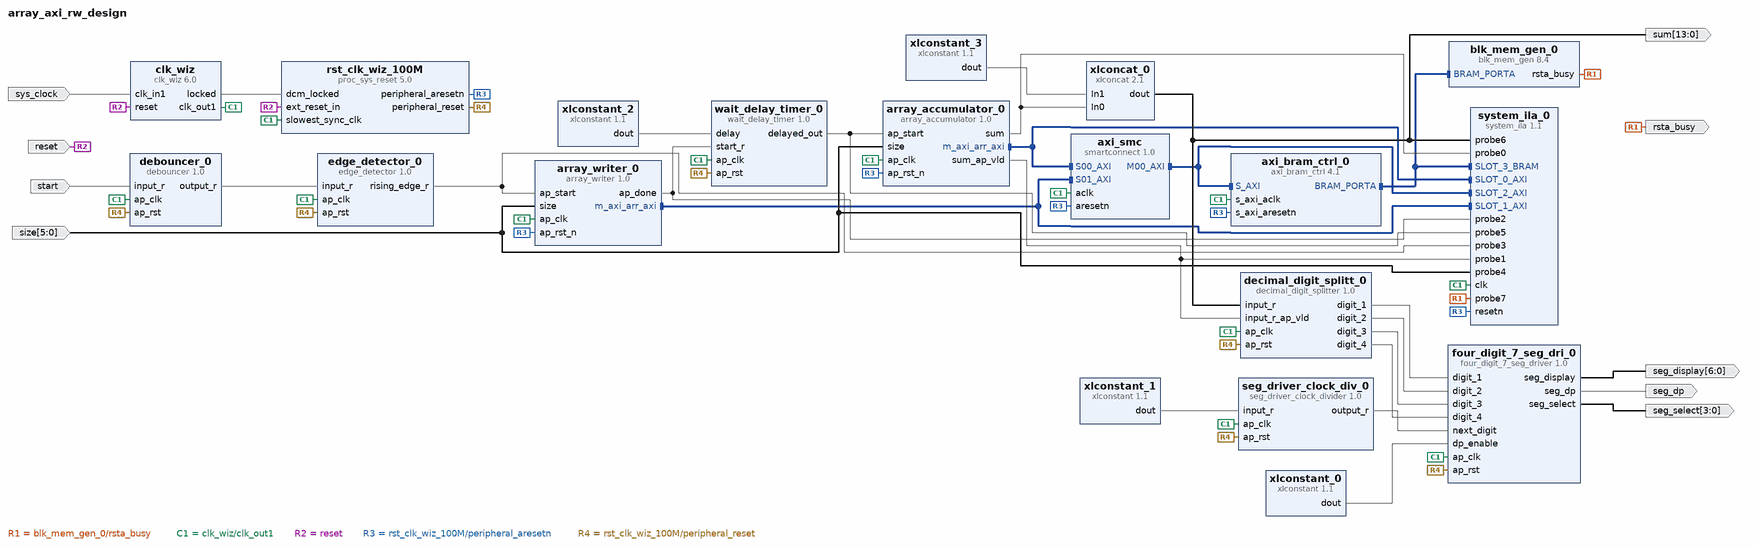
[diagram p0: block diagram of the top level]
# Vivado block design array_axi_rw_design, xc7a35tcpg236-1, Vivado 2023.2
create_bd_design array_axi_rw_design

create_bd_port -dir I -from 5 -to 0 -type data size
create_bd_port -dir O -from 6 -to 0 -type data seg_display
create_bd_port -dir O -from 3 -to 0 -type data seg_select
create_bd_port -dir O -type data seg_dp
create_bd_port -dir I -type data start
create_bd_port -dir I -type clk sys_clock
set_property -dict {CONFIG.FREQ_HZ 100000000 CONFIG.PHASE 0.0} [get_bd_ports sys_clock]
create_bd_port -dir I -type rst reset
set_property -dict {CONFIG.POLARITY ACTIVE_HIGH} [get_bd_ports reset]
create_bd_port -dir O -from 13 -to 0 sum
create_bd_port -dir O rsta_busy

create_bd_cell -type ip -vlnv xilinx.com:hls:array_accumulator:1.0 array_accumulator_0
create_bd_cell -type ip -vlnv xilinx.com:ip:xlconcat:2.1 xlconcat_0
set_property -dict {CONFIG.IN0_WIDTH 13 CONFIG.IN1_WIDTH 1} [get_bd_cells xlconcat_0]
create_bd_cell -type ip -vlnv xilinx.com:hls:decimal_digit_splitter:1.0 decimal_digit_splitt_0
create_bd_cell -type ip -vlnv xilinx.com:hls:four_digit_7_seg_driver:1.0 four_digit_7_seg_dri_0
create_bd_cell -type ip -vlnv xilinx.com:ip:xlconstant:1.1 xlconstant_0
set_property -dict {CONFIG.CONST_VAL 0 CONFIG.CONST_WIDTH 4} [get_bd_cells xlconstant_0]
create_bd_cell -type ip -vlnv xilinx.com:hls:seg_driver_clock_divider:1.0 seg_driver_clock_div_0
create_bd_cell -type ip -vlnv xilinx.com:ip:xlconstant:1.1 xlconstant_1
create_bd_cell -type ip -vlnv xilinx.com:hls:array_writer:1.0 array_writer_0
create_bd_cell -type ip -vlnv xilinx.com:hls:wait_delay_timer:1.0 wait_delay_timer_0
create_bd_cell -type ip -vlnv xilinx.com:ip:xlconstant:1.1 xlconstant_2
set_property -dict {CONFIG.CONST_VAL 3 CONFIG.CONST_WIDTH 8} [get_bd_cells xlconstant_2]
create_bd_cell -type ip -vlnv xilinx.com:ip:axi_bram_ctrl:4.1 axi_bram_ctrl_0
set_property -dict {CONFIG.SINGLE_PORT_BRAM 1} [get_bd_cells axi_bram_ctrl_0]
create_bd_cell -type ip -vlnv xilinx.com:ip:blk_mem_gen:8.4 blk_mem_gen_0
create_bd_cell -type ip -vlnv xilinx.com:ip:clk_wiz:6.0 clk_wiz
set_property -dict [list \
  CONFIG.CLK_IN1_BOARD_INTERFACE sys_clock \
  CONFIG.RESET_BOARD_INTERFACE reset \
  CONFIG.USE_BOARD_FLOW true \
] [get_bd_cells clk_wiz]
create_bd_cell -type ip -vlnv xilinx.com:ip:proc_sys_reset:5.0 rst_clk_wiz_100M
set_property -dict {CONFIG.RESET_BOARD_INTERFACE reset CONFIG.USE_BOARD_FLOW true} [get_bd_cells rst_clk_wiz_100M]
create_bd_cell -type ip -vlnv xilinx.com:ip:smartconnect:1.0 axi_smc
set_property -dict {CONFIG.NUM_SI 2} [get_bd_cells axi_smc]
create_bd_cell -type ip -vlnv xilinx.com:ip:xlconstant:1.1 xlconstant_3
set_property -dict {CONFIG.CONST_VAL 0} [get_bd_cells xlconstant_3]
create_bd_cell -type ip -vlnv xilinx.com:hls:debouncer:1.0 debouncer_0
create_bd_cell -type ip -vlnv xilinx.com:hls:edge_detector:1.0 edge_detector_0
create_bd_cell -type ip -vlnv xilinx.com:ip:system_ila:1.1 system_ila_0
set_property -dict [list \
  CONFIG.C_ADV_TRIGGER true \
  CONFIG.C_EN_STRG_QUAL 1 \
  CONFIG.C_MON_TYPE MIX \
  CONFIG.C_NUM_MONITOR_SLOTS 4 \
  CONFIG.C_NUM_OF_PROBES 8 \
  CONFIG.C_PROBE0_TYPE 0 \
  CONFIG.C_PROBE1_TYPE 0 \
  CONFIG.C_PROBE2_TYPE 0 \
  CONFIG.C_PROBE3_TYPE 0 \
  CONFIG.C_PROBE4_TYPE 0 \
  CONFIG.C_PROBE5_TYPE 0 \
  CONFIG.C_PROBE_WIDTH_PROPAGATION AUTO \
  CONFIG.C_SLOT_0_APC_EN 0 \
  CONFIG.C_SLOT_0_AXI_AR_SEL_DATA 1 \
  CONFIG.C_SLOT_0_AXI_AR_SEL_TRIG 1 \
  CONFIG.C_SLOT_0_AXI_AW_SEL_DATA 0 \
  CONFIG.C_SLOT_0_AXI_AW_SEL_TRIG 0 \
  CONFIG.C_SLOT_0_AXI_B_SEL_DATA 0 \
  CONFIG.C_SLOT_0_AXI_B_SEL_TRIG 0 \
  CONFIG.C_SLOT_0_AXI_R_SEL_DATA 1 \
  CONFIG.C_SLOT_0_AXI_R_SEL_TRIG 1 \
  CONFIG.C_SLOT_0_AXI_W_SEL_DATA 0 \
  CONFIG.C_SLOT_0_AXI_W_SEL_TRIG 0 \
  CONFIG.C_SLOT_0_INTF_TYPE xilinx.com:interface:aximm_rtl:1.0 \
  CONFIG.C_SLOT_1_APC_EN 0 \
  CONFIG.C_SLOT_1_AXI_AR_SEL_DATA 0 \
  CONFIG.C_SLOT_1_AXI_AR_SEL_TRIG 0 \
  CONFIG.C_SLOT_1_AXI_AW_SEL_DATA 1 \
  CONFIG.C_SLOT_1_AXI_AW_SEL_TRIG 1 \
  CONFIG.C_SLOT_1_AXI_B_SEL_DATA 1 \
  CONFIG.C_SLOT_1_AXI_B_SEL_TRIG 1 \
  CONFIG.C_SLOT_1_AXI_R_SEL_DATA 0 \
  CONFIG.C_SLOT_1_AXI_R_SEL_TRIG 0 \
  CONFIG.C_SLOT_1_AXI_W_SEL_DATA 1 \
  CONFIG.C_SLOT_1_AXI_W_SEL_TRIG 1 \
  CONFIG.C_SLOT_1_INTF_TYPE xilinx.com:interface:aximm_rtl:1.0 \
  CONFIG.C_SLOT_2_APC_EN 0 \
  CONFIG.C_SLOT_2_AXI_AR_SEL_DATA 1 \
  CONFIG.C_SLOT_2_AXI_AR_SEL_TRIG 1 \
  CONFIG.C_SLOT_2_AXI_AW_SEL_DATA 1 \
  CONFIG.C_SLOT_2_AXI_AW_SEL_TRIG 1 \
  CONFIG.C_SLOT_2_AXI_B_SEL_DATA 1 \
  CONFIG.C_SLOT_2_AXI_B_SEL_TRIG 1 \
  CONFIG.C_SLOT_2_AXI_R_SEL_DATA 1 \
  CONFIG.C_SLOT_2_AXI_R_SEL_TRIG 1 \
  CONFIG.C_SLOT_2_AXI_W_SEL_DATA 1 \
  CONFIG.C_SLOT_2_AXI_W_SEL_TRIG 1 \
  CONFIG.C_SLOT_2_INTF_TYPE xilinx.com:interface:aximm_rtl:1.0 \
  CONFIG.C_SLOT_3_INTF_TYPE xilinx.com:interface:bram_rtl:1.0 \
  CONFIG.C_SLOT_3_TYPE 0 \
] [get_bd_cells system_ila_0]

# ---- connections ----

connect_bd_intf_net -intf_net array_accumulator_0_m_axi_arr_axi [get_bd_intf_pins array_accumulator_0/m_axi_arr_axi] [get_bd_intf_pins axi_smc/S00_AXI]
connect_bd_intf_net [get_bd_intf_pins array_accumulator_0/m_axi_arr_axi] [get_bd_intf_pins system_ila_0/SLOT_0_AXI]
connect_bd_intf_net -intf_net array_writer_0_m_axi_arr_axi [get_bd_intf_pins array_writer_0/m_axi_arr_axi] [get_bd_intf_pins axi_smc/S01_AXI]
connect_bd_intf_net [get_bd_intf_pins array_writer_0/m_axi_arr_axi] [get_bd_intf_pins system_ila_0/SLOT_1_AXI]
connect_bd_intf_net -intf_net axi_bram_ctrl_0_BRAM_PORTA [get_bd_intf_pins axi_bram_ctrl_0/BRAM_PORTA] [get_bd_intf_pins blk_mem_gen_0/BRAM_PORTA]
connect_bd_intf_net [get_bd_intf_pins axi_bram_ctrl_0/BRAM_PORTA] [get_bd_intf_pins system_ila_0/SLOT_3_BRAM]
connect_bd_intf_net -intf_net axi_smc_M00_AXI [get_bd_intf_pins axi_smc/M00_AXI] [get_bd_intf_pins axi_bram_ctrl_0/S_AXI]
connect_bd_intf_net [get_bd_intf_pins axi_smc/M00_AXI] [get_bd_intf_pins system_ila_0/SLOT_2_AXI]
connect_bd_net -net array_accumulator_0_sum [get_bd_pins array_accumulator_0/sum] [get_bd_pins xlconcat_0/In0] [get_bd_pins system_ila_0/probe0]
connect_bd_net -net array_accumulator_0_sum_ap_vld [get_bd_pins array_accumulator_0/sum_ap_vld] \
  [get_bd_pins decimal_digit_splitt_0/input_r_ap_vld] [get_bd_pins system_ila_0/probe1]
connect_bd_net -net array_writer_0_ap_done [get_bd_pins array_writer_0/ap_done] \
  [get_bd_pins wait_delay_timer_0/start_r] [get_bd_pins system_ila_0/probe2]
connect_bd_net [get_bd_pins blk_mem_gen_0/rsta_busy] [get_bd_ports rsta_busy] [get_bd_pins system_ila_0/probe7]
connect_bd_net [get_bd_pins clk_wiz/clk_out1] \
  [get_bd_pins rst_clk_wiz_100M/slowest_sync_clk] [get_bd_pins decimal_digit_splitt_0/ap_clk] \
  [get_bd_pins four_digit_7_seg_dri_0/ap_clk] [get_bd_pins seg_driver_clock_div_0/ap_clk] \
  [get_bd_pins array_accumulator_0/ap_clk] [get_bd_pins wait_delay_timer_0/ap_clk] [get_bd_pins axi_smc/aclk] \
  [get_bd_pins axi_bram_ctrl_0/s_axi_aclk] [get_bd_pins array_writer_0/ap_clk] [get_bd_pins debouncer_0/ap_clk] \
  [get_bd_pins edge_detector_0/ap_clk] [get_bd_pins system_ila_0/clk]
connect_bd_net [get_bd_pins clk_wiz/locked] [get_bd_pins rst_clk_wiz_100M/dcm_locked]
connect_bd_net [get_bd_pins debouncer_0/output_r] [get_bd_pins edge_detector_0/input_r]
connect_bd_net [get_bd_pins decimal_digit_splitt_0/digit_1] [get_bd_pins four_digit_7_seg_dri_0/digit_1]
connect_bd_net [get_bd_pins decimal_digit_splitt_0/digit_2] [get_bd_pins four_digit_7_seg_dri_0/digit_2]
connect_bd_net [get_bd_pins decimal_digit_splitt_0/digit_3] [get_bd_pins four_digit_7_seg_dri_0/digit_3]
connect_bd_net [get_bd_pins decimal_digit_splitt_0/digit_4] [get_bd_pins four_digit_7_seg_dri_0/digit_4]
connect_bd_net -net edge_detector_0_rising_edge_r [get_bd_pins edge_detector_0/rising_edge_r] \
  [get_bd_pins array_writer_0/ap_start] [get_bd_pins system_ila_0/probe3]
connect_bd_net [get_bd_pins four_digit_7_seg_dri_0/seg_display] [get_bd_ports seg_display]
connect_bd_net [get_bd_pins four_digit_7_seg_dri_0/seg_dp] [get_bd_ports seg_dp]
connect_bd_net [get_bd_pins four_digit_7_seg_dri_0/seg_select] [get_bd_ports seg_select]
connect_bd_net [get_bd_ports reset] [get_bd_pins clk_wiz/reset] [get_bd_pins rst_clk_wiz_100M/ext_reset_in]
connect_bd_net [get_bd_pins rst_clk_wiz_100M/peripheral_aresetn] \
  [get_bd_pins array_accumulator_0/ap_rst_n] [get_bd_pins axi_bram_ctrl_0/s_axi_aresetn] [get_bd_pins axi_smc/aresetn] \
  [get_bd_pins array_writer_0/ap_rst_n] [get_bd_pins system_ila_0/resetn]
connect_bd_net [get_bd_pins rst_clk_wiz_100M/peripheral_reset] \
  [get_bd_pins decimal_digit_splitt_0/ap_rst] [get_bd_pins four_digit_7_seg_dri_0/ap_rst] \
  [get_bd_pins seg_driver_clock_div_0/ap_rst] [get_bd_pins wait_delay_timer_0/ap_rst] [get_bd_pins debouncer_0/ap_rst] \
  [get_bd_pins edge_detector_0/ap_rst]
connect_bd_net [get_bd_pins seg_driver_clock_div_0/output_r] [get_bd_pins four_digit_7_seg_dri_0/next_digit]
connect_bd_net -net size_0_1 [get_bd_ports size] \
  [get_bd_pins array_writer_0/size] [get_bd_pins array_accumulator_0/size] [get_bd_pins system_ila_0/probe4]
connect_bd_net [get_bd_ports start] [get_bd_pins debouncer_0/input_r]
connect_bd_net [get_bd_ports sys_clock] [get_bd_pins clk_wiz/clk_in1]
connect_bd_net -net wait_delay_timer_0_delayed_out [get_bd_pins wait_delay_timer_0/delayed_out] \
  [get_bd_pins array_accumulator_0/ap_start] [get_bd_pins system_ila_0/probe5]
connect_bd_net -net xlconcat_0_dout [get_bd_pins xlconcat_0/dout] \
  [get_bd_ports sum] [get_bd_pins decimal_digit_splitt_0/input_r] [get_bd_pins system_ila_0/probe6]
connect_bd_net [get_bd_pins xlconstant_0/dout] [get_bd_pins four_digit_7_seg_dri_0/dp_enable]
connect_bd_net [get_bd_pins xlconstant_1/dout] [get_bd_pins seg_driver_clock_div_0/input_r]
connect_bd_net [get_bd_pins xlconstant_2/dout] [get_bd_pins wait_delay_timer_0/delay]
connect_bd_net [get_bd_pins xlconstant_3/dout] [get_bd_pins xlconcat_0/In1]
set_property HDL_ATTRIBUTE.DEBUG true [get_bd_intf_nets array_accumulator_0_m_axi_arr_axi]
set_property HDL_ATTRIBUTE.MARK_DEBUG true [get_bd_intf_nets array_accumulator_0_m_axi_arr_axi]
set_property HDL_ATTRIBUTE.DEBUG true [get_bd_intf_nets array_writer_0_m_axi_arr_axi]
set_property HDL_ATTRIBUTE.MARK_DEBUG true [get_bd_intf_nets array_writer_0_m_axi_arr_axi]
set_property HDL_ATTRIBUTE.DEBUG true [get_bd_intf_nets axi_bram_ctrl_0_BRAM_PORTA]
set_property HDL_ATTRIBUTE.MARK_DEBUG true [get_bd_intf_nets axi_bram_ctrl_0_BRAM_PORTA]
set_property HDL_ATTRIBUTE.DEBUG true [get_bd_intf_nets axi_smc_M00_AXI]
set_property HDL_ATTRIBUTE.MARK_DEBUG true [get_bd_intf_nets axi_smc_M00_AXI]
set_property HDL_ATTRIBUTE.DEBUG true [get_bd_nets array_accumulator_0_sum]
set_property HDL_ATTRIBUTE.MARK_DEBUG true [get_bd_nets array_accumulator_0_sum]
set_property HDL_ATTRIBUTE.DEBUG true [get_bd_nets array_accumulator_0_sum_ap_vld]
set_property HDL_ATTRIBUTE.MARK_DEBUG true [get_bd_nets array_accumulator_0_sum_ap_vld]
set_property HDL_ATTRIBUTE.DEBUG true [get_bd_nets array_writer_0_ap_done]
set_property HDL_ATTRIBUTE.MARK_DEBUG true [get_bd_nets array_writer_0_ap_done]
set_property HDL_ATTRIBUTE.DEBUG true [get_bd_nets edge_detector_0_rising_edge_r]
set_property HDL_ATTRIBUTE.MARK_DEBUG true [get_bd_nets edge_detector_0_rising_edge_r]
set_property HDL_ATTRIBUTE.DEBUG true [get_bd_nets size_0_1]
set_property HDL_ATTRIBUTE.MARK_DEBUG true [get_bd_nets size_0_1]
set_property HDL_ATTRIBUTE.DEBUG true [get_bd_nets wait_delay_timer_0_delayed_out]
set_property HDL_ATTRIBUTE.MARK_DEBUG true [get_bd_nets wait_delay_timer_0_delayed_out]
set_property HDL_ATTRIBUTE.DEBUG true [get_bd_nets xlconcat_0_dout]
set_property HDL_ATTRIBUTE.MARK_DEBUG true [get_bd_nets xlconcat_0_dout]

# ---- address map ----
assign_bd_address -offset 0x0000000000000000 -range 8K -target_address_space [get_bd_addr_spaces array_accumulator_0/Data_m_axi_arr_axi] [get_bd_addr_segs axi_bram_ctrl_0/S_AXI/Mem0]
assign_bd_address -offset 0x0000000000000000 -range 8K -target_address_space [get_bd_addr_spaces array_writer_0/Data_m_axi_arr_axi] [get_bd_addr_segs axi_bram_ctrl_0/S_AXI/Mem0]

validate_bd_design
save_bd_design
